# EAGLE design ESP8266-SeeedBreakoutBoardMinimal (EAGLE 7.1.0)
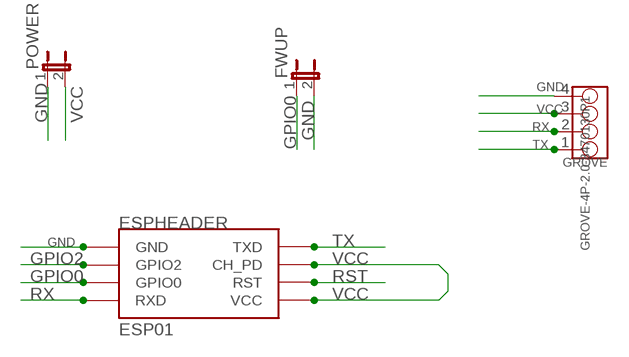
[diagram p0: schematic, sheet 1]

## Parts
ESPHEADER  ESP01  [ESP01]
FWUP  JUMPER-2PTH  [1X02]
GROVE  GROVE-4P-2.0-3470130P1  [4P-2.0]
POWER  JUMPER-2PTH  [1X02]

## Nets
GND: ESPHEADER.GND FWUP.2 GROVE.4 POWER.1
GPIO0: ESPHEADER.GPIO0 FWUP.1
GPIO2: ESPHEADER.GPIO2
RST: ESPHEADER.RST
RX: ESPHEADER.RX(RXD) GROVE.2
TX: ESPHEADER.TX(TXD) GROVE.1
VCC: ESPHEADER.CH_PD ESPHEADER.VCC GROVE.3 POWER.2

## Library data of the parts
ESPHEADER = esp8266modules:ESP01: ESP8266 Wifi module 01
FWUP POWER = SparkFun-Retired:JUMPER-2: Jumper Basic 0.1" spaced jumper. Use with breakaway headers.
GROVE = Connector:GROVE-4P-2.0

## Board
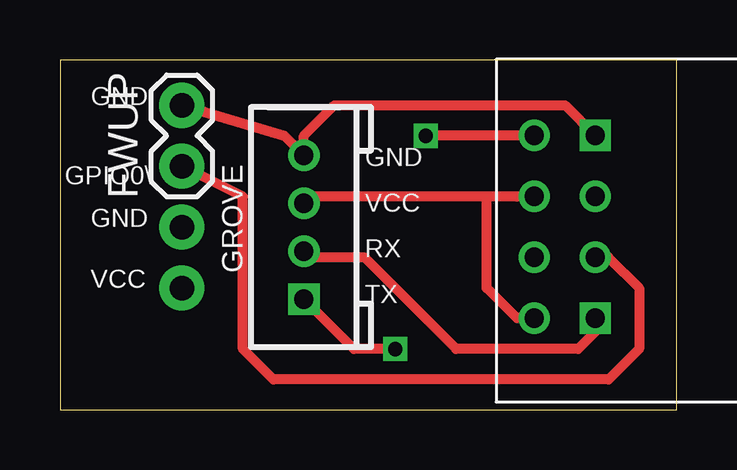
[diagram p1: board, top side]
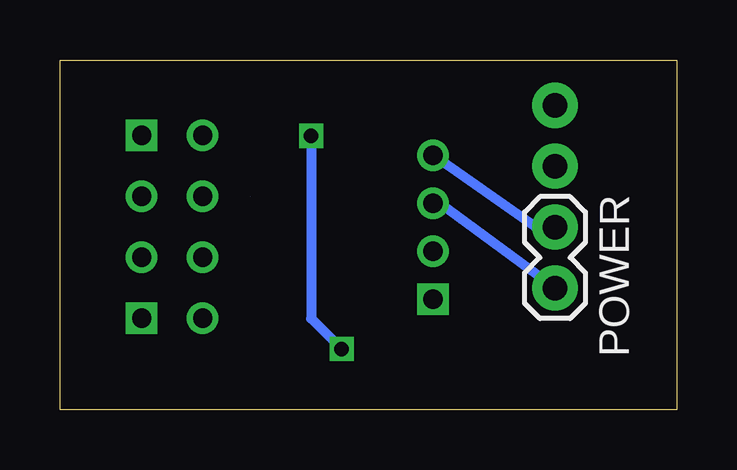
[diagram p2: board, bottom side, seen from below]

Size 25.71 x 14.6 mm. Coordinates in mm from the lower left corner, seen from the top.
Outline: 0,0 25.71,0 25.71,14.6 0,14.6 0,0
Copper layers (1*16): Top 0.035mm / dielectric 1.5mm / Bottom 0.035mm
Design rules "default": minimum track width 10mil, minimum drill 24mil, track to track 8mil, track to pad 8mil, pad to pad 8mil, via to via 8mil, smd to smd 8mil, copper to edge 40mil, drill to drill 8mil, minimum pad ring 10mil, minimum via ring 8mil, stop-mask expansion 4mil, vias tented up to drill 0mil, thermal gap 10mil

### Footprints (pad centres in the part's own frame; a part is rotated, then mirrored left to right if it is on the bottom)
ESP01 = drill 0.8: CH_PD -1.285,-8.178; GPIO0 1.255,-5.638; GPIO2 -1.285,-5.638; RST 1.255,-8.178; TX -3.825,-8.178; VCC 3.795,-8.178 | drill 0.8 square: GND -3.825,-5.638; RX 3.795,-5.638
1X02 = drill 1.016 pad 1.88: 1 0,0; 2 2.54,0
4P-2.0 = drill 0.8 pad 1.27 square: 1 -3,0 | drill 0.8 pad 1.27: 2 -1,0; 3 1,0; 4 3,0

### Placement (x,y rotation side)
ESPHEADER  27.94,7.62 270 top
FWUP  5.08,10.16 90 top
GROVE  10.16,7.62 90 top
POWER  5.08,7.62 270 bottom

### Tracks (layer width: path | path; a pad name or v marks a point on that pad's centre or on a via)
GND
  Top 0.406: GROVE.4 10.16,10.16 | GROVE.4 10.16,11.43 11.43,12.7 21.05,12.7 ESPHEADER.GND | FWUP.2 9.35,11.43 GROVE.4
  Bottom 0.406: POWER.1 5.89,7.62 GROVE.4
GPIO0
  Top 0.406: ESPHEADER.GPIO0 22.85,6.37 24.13,5.08 24.13,2.54 22.86,1.27 8.89,1.27 7.62,2.54 7.62,8.89 FWUP.1
RX
  Top 0.406: ESPHEADER.RX 22.3,3.25 21.59,2.54 16.51,2.54 12.7,6.35 10.43,6.35 GROVE.2
TX  (via drill 0.6)
  Top 0.406: ESPHEADER.TX 15.26,11.45 v15.24,11.43 | v13.97,2.54 12.24,2.54 GROVE.1
  Bottom 0.406: v15.24,11.43 15.24,3.81 v13.97,2.54
VCC  (1 unrouted)
  Top 0.406: GROVE.3 10.45,8.91 ESPHEADER.CH_PD 19.06,8.91 19.05,8.89 | ESPHEADER.VCC 19.04,3.83 17.78,5.08 17.78,8.89
  Bottom 0.406: GROVE.3 9.89,8.62 POWER.2

### Text on the board
tNames: GND | GPIO0\ | GND | VCC | GND | RX | VCC | TX